# EAGLE design Sensor-amplification_V4 (EAGLE 6.6.0)
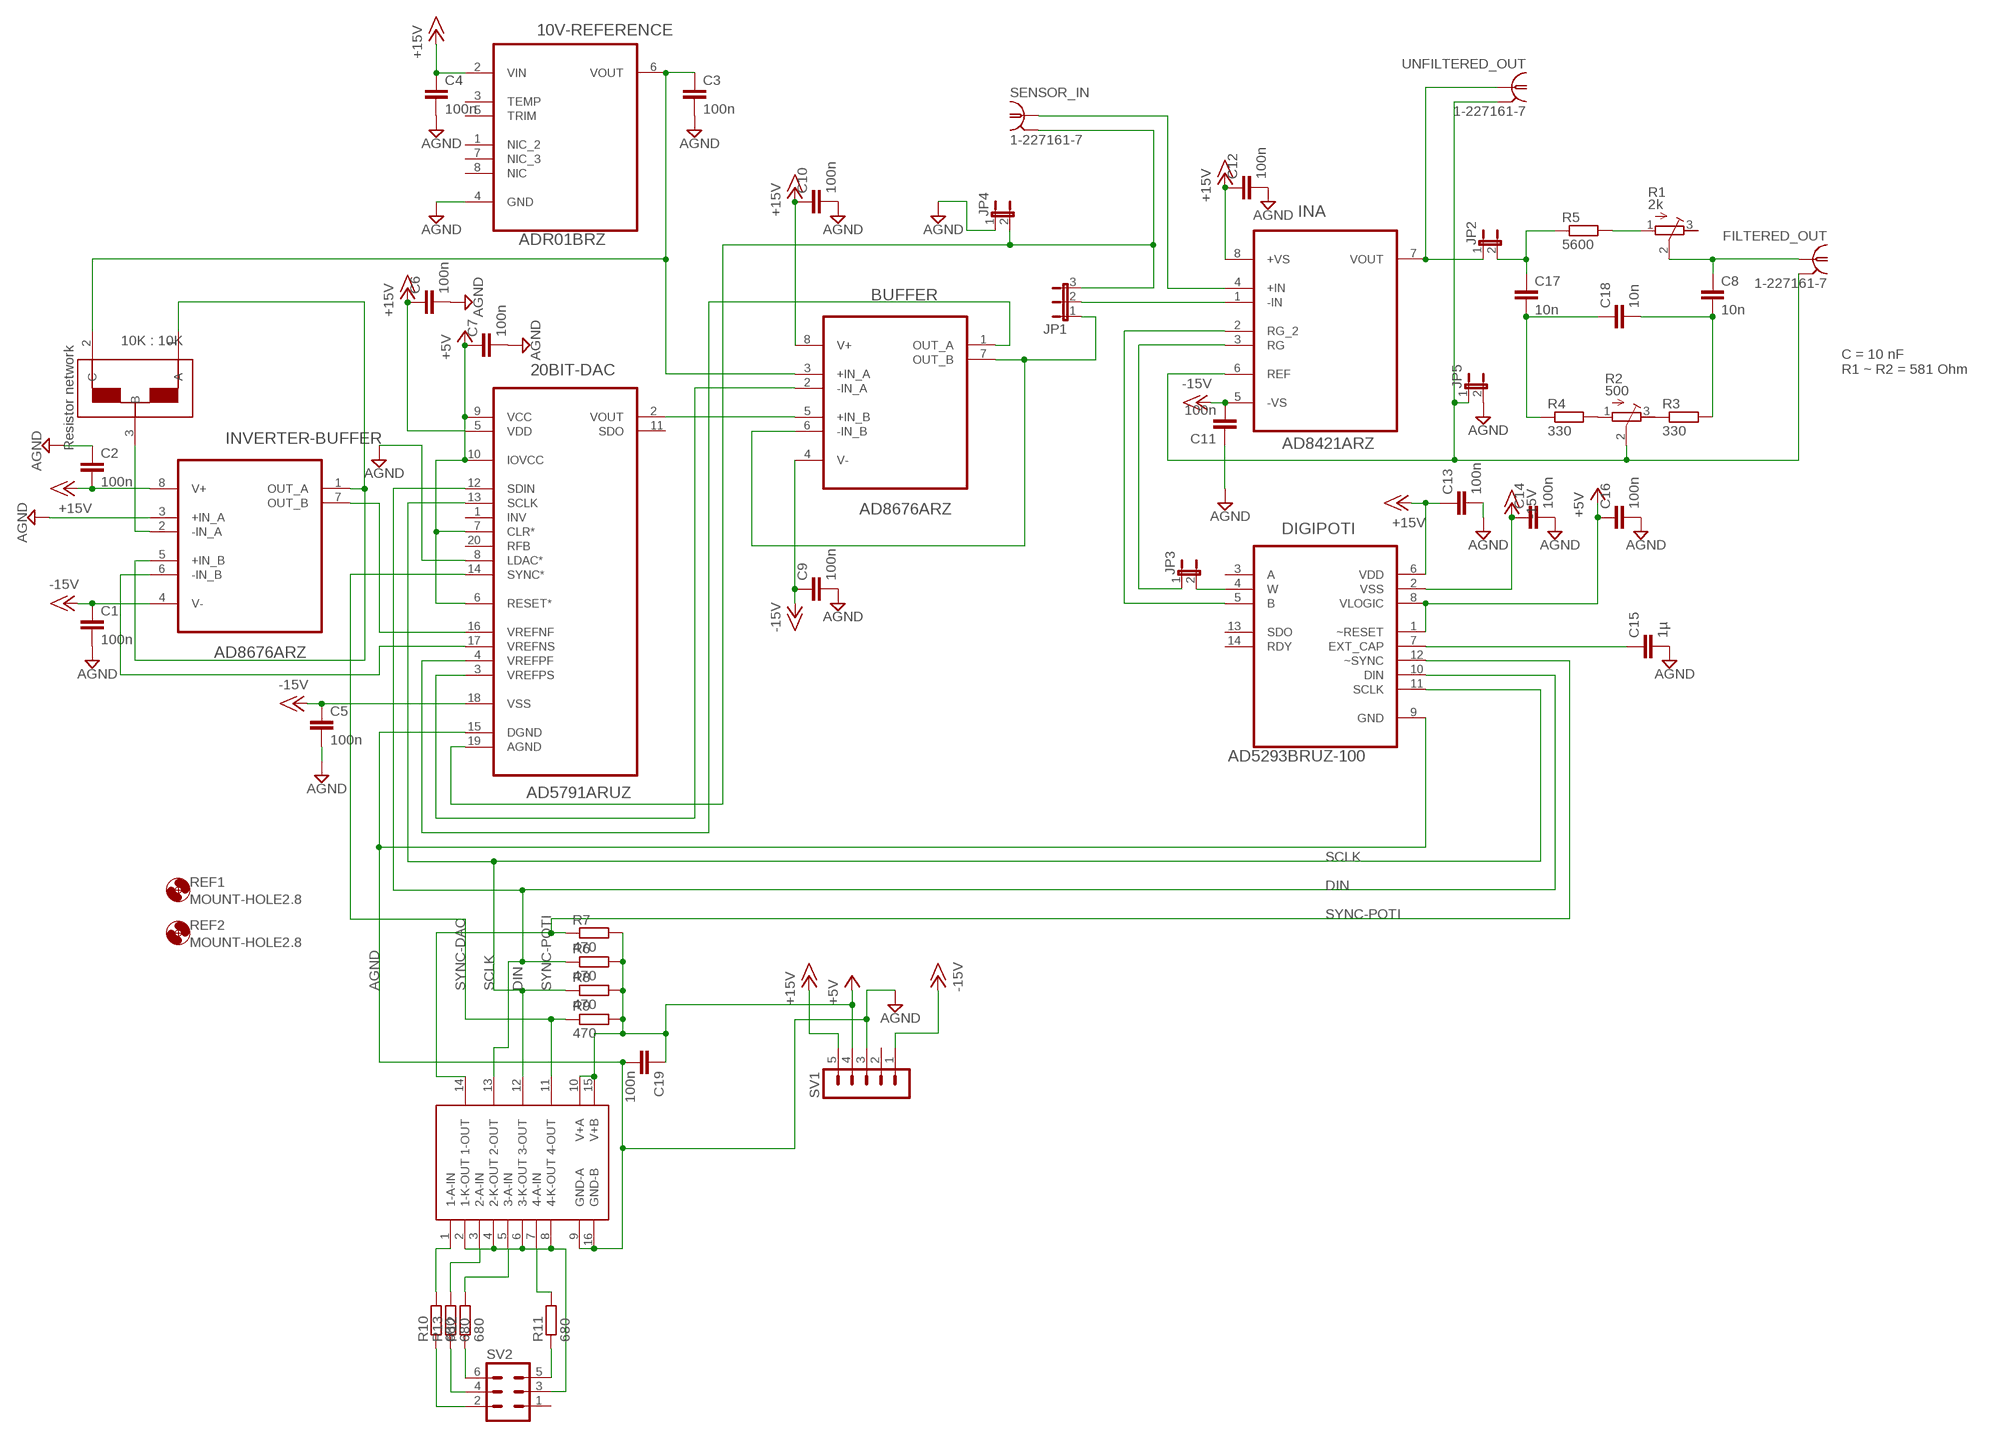
[diagram p0: schematic, sheet 1]

## Parts
10V-REFERENCE  ADR01BRZ  [SOIC127P600X175-8N]
20BIT-DAC  AD5791ARUZ  [SOP65P640X120-20N]
BUFFER  AD8676ARZ  [SOIC127P600X175-8N]
C1  100n  C-EUC0603  [C0603]
C2  100n  C-EUC0603  [C0603]
C3  100n  C-EUC0603  [C0603]
C4  100n  C-EUC0603  [C0603]
C5  100n  C-EUC0603  [C0603]
C6  100n  C-EUC0603  [C0603]
C7  100n  C-EUC0603  [C0603]
C8  10n  C-EUC0805  [C0805]
C9  100n  C-EUC0603  [C0603]
C10  100n  C-EUC0603  [C0603]
C11  100n  C-EUC0603  [C0603]
C12  100n  C-EUC0603  [C0603]
C13  100n  C-EUC0603  [C0603]
C14  100n  C-EUC0603  [C0603]
C15  1µ  C-EUC0603  [C0603]
C16  100n  C-EUC0603  [C0603]
C17  10n  C-EUC0805  [C0805]
C18  10n  C-EUC0805  [C0805]
C19  100n  C-EUC0603  [C0603]
DIGIPOTI  AD5293BRUZ-100  [SOP65P640X120-14N]
FILTERED_OUT  1-227161-7  [AMP_227161]
INA  AD8421ARZ  [SOIC127P600X175-8N]
INVERTER-BUFFER  AD8676ARZ  [SOIC127P600X175-8N]
JP1  JP2E  [JP2]
JP2  JP1E  [JP1]
JP3  JP1E  [JP1]
JP4  JP1E  [JP1]
JP5  JP1E  [JP1]
OPTOCOUPLER  ACSL-6400  [SO16]
R1  2k  R-TRIMM64W  [RTRIM64W]
R2  500  R-TRIMM64W  [RTRIM64W]
R3  330  R-EU_M1206  [M1206]
R4  330  R-EU_M1206  [M1206]
R5  5600  R-EU_M1206  [M1206]
R6  470  R-EU_M1206  [M1206]
R7  470  R-EU_M1206  [M1206]
R8  470  R-EU_M1206  [M1206]
R9  470  R-EU_M1206  [M1206]
R10  680  R-EU_M1206  [M1206]
R11  680  R-EU_M1206  [M1206]
R12  680  R-EU_M1206  [M1206]
R13  680  R-EU_M1206  [M1206]
R20  MPMT2001AT5  [SOT23]
REF1  MOUNT-HOLE2.8  [2,8]
REF2  MOUNT-HOLE2.8  [2,8]
SENSOR_IN  1-227161-7  [AMP_227161]
SV1  MA05-1  [MA05-1]
SV2  MA03-2  [MA03-2]
UNFILTERED_OUT  1-227161-7  [AMP_227161]

## Nets
+5V: 20BIT-DAC.6(RESET*) 20BIT-DAC.7(CLR*) 20BIT-DAC.9(VCC) 20BIT-DAC.10(IOVCC) C7.1 C16.1 C19.1 DIGIPOTI.1(~RESET) DIGIPOTI.8(VLOGIC) OPTOCOUPLER.10(V+A) OPTOCOUPLER.15(V+B) R6.2 R7.2 R8.2 R9.2 SV1.4
+15V: 10V-REFERENCE.2(VIN) 20BIT-DAC.5(VDD) BUFFER.8(V+) C2.2 C4.1 C6.1 C10.1 C12.1 C13.1 DIGIPOTI.6(VDD) INA.8(+VS) INVERTER-BUFFER.8(V+) SV1.5
-15V: 20BIT-DAC.18(VSS) BUFFER.4(V-) C1.1 C5.1 C9.1 C11.2 C14.1 DIGIPOTI.2(VSS) INA.5(-VS) INVERTER-BUFFER.4(V-) SV1.1
AGND: 10V-REFERENCE.4(GND) 20BIT-DAC.8(LDAC*) 20BIT-DAC.15(DGND) C1.2 C2.1 C3.2 C4.2 C5.2 C6.2 C7.2 C9.2 C10.2 C11.1 C12.2 C13.2 C14.2 C15.2 C16.2 C19.2 DIGIPOTI.9(GND) INVERTER-BUFFER.3(+IN_A) JP4.1 JP5.2 OPTOCOUPLER.9(GND-A) OPTOCOUPLER.16(GND-B) SV1.3
DIN: 20BIT-DAC.12(SDIN) DIGIPOTI.10(DIN) OPTOCOUPLER.13(2-OUT) R6.1
N$1: INA.7(VOUT) JP2.1 UNFILTERED_OUT.1
N$2: FILTERED_OUT.2 INA.6(REF) JP5.1 R2.2(S) UNFILTERED_OUT.2
N$3: INA.3(RG) JP3.1
N$4: DIGIPOTI.5(B) INA.2(RG_2)
N$5: INA.4(+IN) SENSOR_IN.1
N$6: 20BIT-DAC.19(AGND) JP1.3 JP4.2 SENSOR_IN.2
N$7: INA.1(-IN) JP1.2
N$8: DIGIPOTI.4(W) JP3.2
N$9: 10V-REFERENCE.6(VOUT) BUFFER.3(+IN_A) C3.1 R20.2(C)
N$10: 20BIT-DAC.2(VOUT) BUFFER.5(+IN_B)
N$11: 20BIT-DAC.4(VREFPF) BUFFER.1(OUT_A)
N$12: 20BIT-DAC.3(VREFPS) BUFFER.2(-IN_A)
N$13: INVERTER-BUFFER.2(-IN_A) R20.3(B)
N$14: 20BIT-DAC.16(VREFNF) INVERTER-BUFFER.7(OUT_B)
N$15: 20BIT-DAC.17(VREFNS) INVERTER-BUFFER.6(-IN_B)
N$16: INVERTER-BUFFER.1(OUT_A) INVERTER-BUFFER.5(+IN_B) R20.1(A)
N$17: C15.1 DIGIPOTI.7(EXT_CAP)
N$18: C17.2 C18.1 R4.1
N$19: C8.2 C18.2 R3.2
N$20: C8.1 FILTERED_OUT.1 R1.2(S)
N$21: C17.1 JP2.2 R5.1
N$22: R2.3(E) R3.1
N$23: R2.1(A) R4.2
N$24: R1.1(A) R5.2
N$25: OPTOCOUPLER.2(1-K-OUT) OPTOCOUPLER.4(2-K-OUT) OPTOCOUPLER.6(3-K-OUT) OPTOCOUPLER.8(4-K-OUT) SV2.3
N$26: OPTOCOUPLER.7(4-A-IN) R11.2
N$27: OPTOCOUPLER.5(3-A-IN) R12.2
N$28: OPTOCOUPLER.3(2-A-IN) R13.2
N$29: R10.1 SV2.2
N$30: OPTOCOUPLER.1(1-A-IN) R10.2
N$31: R13.1 SV2.4
N$32: R12.1 SV2.6
N$33: R11.1 SV2.5
SCLK: 20BIT-DAC.13(SCLK) DIGIPOTI.11(SCLK) OPTOCOUPLER.12(3-OUT) R8.1
SUBSTRACT_SELECT: BUFFER.6(-IN_B) BUFFER.7(OUT_B) JP1.1
SYNC-DAC: 20BIT-DAC.14(SYNC*) OPTOCOUPLER.11(4-OUT) R9.1
SYNC-POTI: DIGIPOTI.12(~SYNC) OPTOCOUPLER.14(1-OUT) R7.1
Unconnected: 10V-REFERENCE.1(NIC_2) 10V-REFERENCE.3(TEMP) 10V-REFERENCE.5(TRIM) 10V-REFERENCE.7(NIC_3) 10V-REFERENCE.8(NIC) 20BIT-DAC.1(INV) 20BIT-DAC.11(SDO) 20BIT-DAC.20(RFB) DIGIPOTI.3(A) DIGIPOTI.13(SDO) DIGIPOTI.14(RDY) R1.3(E) SV1.2 SV2.1

## Notes on the sheet
- 10K : 10K
- C = 10 nF
  R1 ~ R2 = 581 Ohm

## Library data of the parts
10V-REFERENCE = NaLi-specific:ADR01BRZ: Ultracompact, Precision 10.0 V/5.0 V/2.5 V/3.0 V Voltage References; MPN: ADR01BRZ; OC_FARNELL: 2305769; OC_NEWARK: 59K2657; PACKAGE: SOIC-8; SUPPLIER: Analog Devices
20BIT-DAC = NaLi-specific:AD5791ARUZ: Digital-to-Analog Converters; MPN: AD5791ARUZ; OC_FARNELL: 2074863; OC_NEWARK: 18T2142; PACKAGE: TSSOP-20; SUPPLIER: Analog Devices
BUFFER INVERTER-BUFFER = Analog Devices_By_element14_Batch_1:AD8676ARZ: Ultraprecision, 36 V, 2.8 nV/ãHz Dual Rail-to-Rail Output Op Amp; MPN: AD8676ARZ; OC_FARNELL: 1316453; OC_NEWARK: 28M4146; PACKAGE: SOIC-8; SUPPLIER: Analog Devices
C1-C19 = resistor:C-EU: CAPACITOR, European symbol
DIGIPOTI = NaLi-specific:AD5293BRUZ-100: Digital Potentiometers; MPN: AD5293BRUZ-100; OC_FARNELL: -; OC_NEWARK: 52R8122; PACKAGE: TSSOP-14; SUPPLIER: Analog Devices
FILTERED_OUT SENSOR_IN UNFILTERED_OUT = con-coax:?227161*: JACK, RIGHT ANGLE, 50 OHM, PCB, BNC Source: amp_227161.pdf; MF: TYCO ELECTRONICS; MPN: 1-227161-7; OC_FARNELL: unknown; OC_NEWARK: 09H7855
INA = ADI-Phase-2:AD8421ARZ: Instrumentation Amplifier; MPN: AD8421ARZ; OC_FARNELL: 2126090; OC_NEWARK: 94T9482; PACKAGE: SOIC-8; SUPPLIER: Analog Devices
JP1 = jumper:JP2E: JUMPER
JP2-JP5 = jumper:JP1E: JUMPER
OPTOCOUPLER = NaLi-specific:ACSL-6400
R1 R2 = resistor:R-TRIMM: Trimm resistor
R3-R13 = resistor:R-EU_: RESISTOR, European symbol
R20 = NaLi-specific:MPMT2001AT5
REF1 REF2 = holes:MOUNT-HOLE: MOUNTING HOLE with drill center marker
SV1 = con-lstb:MA05-1: PIN HEADER; OC_FARNELL: unknown; OC_NEWARK: unknown
SV2 = con-lstb:MA03-2: PIN HEADER; OC_FARNELL: unknown; OC_NEWARK: unknown

## Board
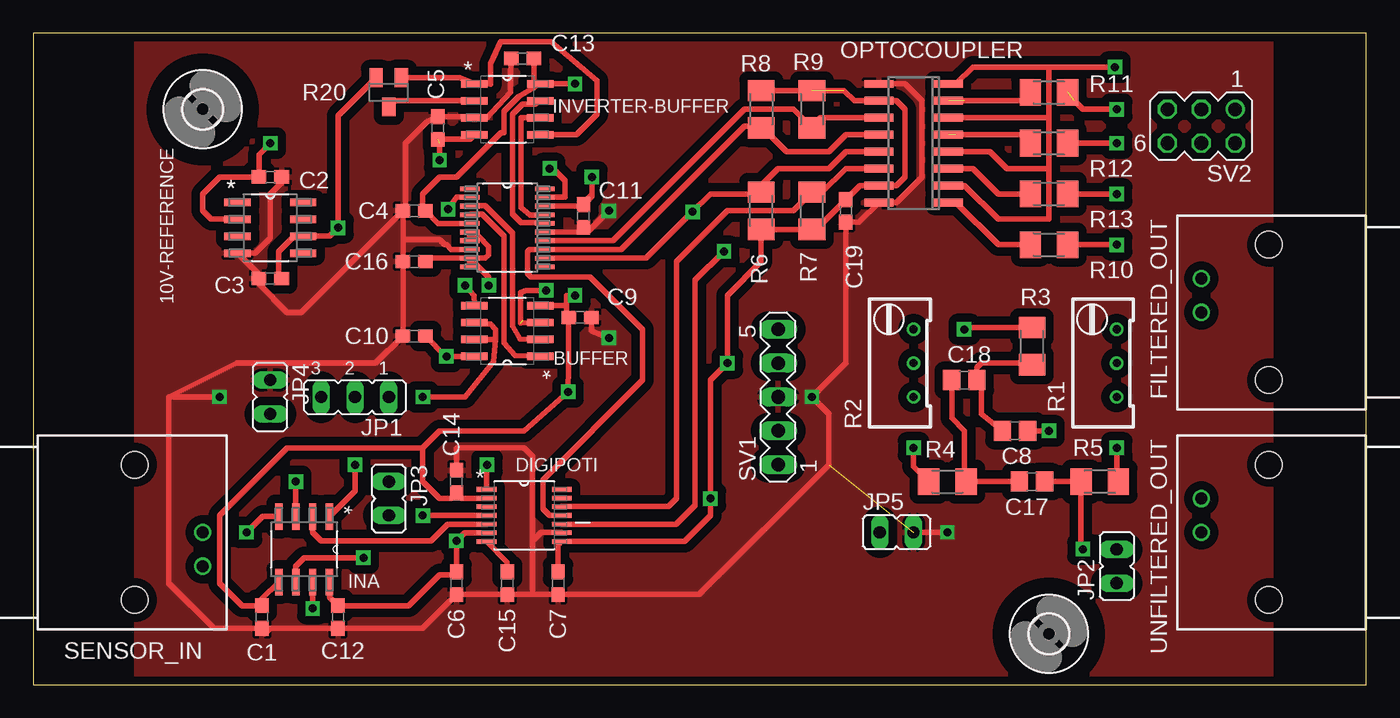
[diagram p1: board, top side]
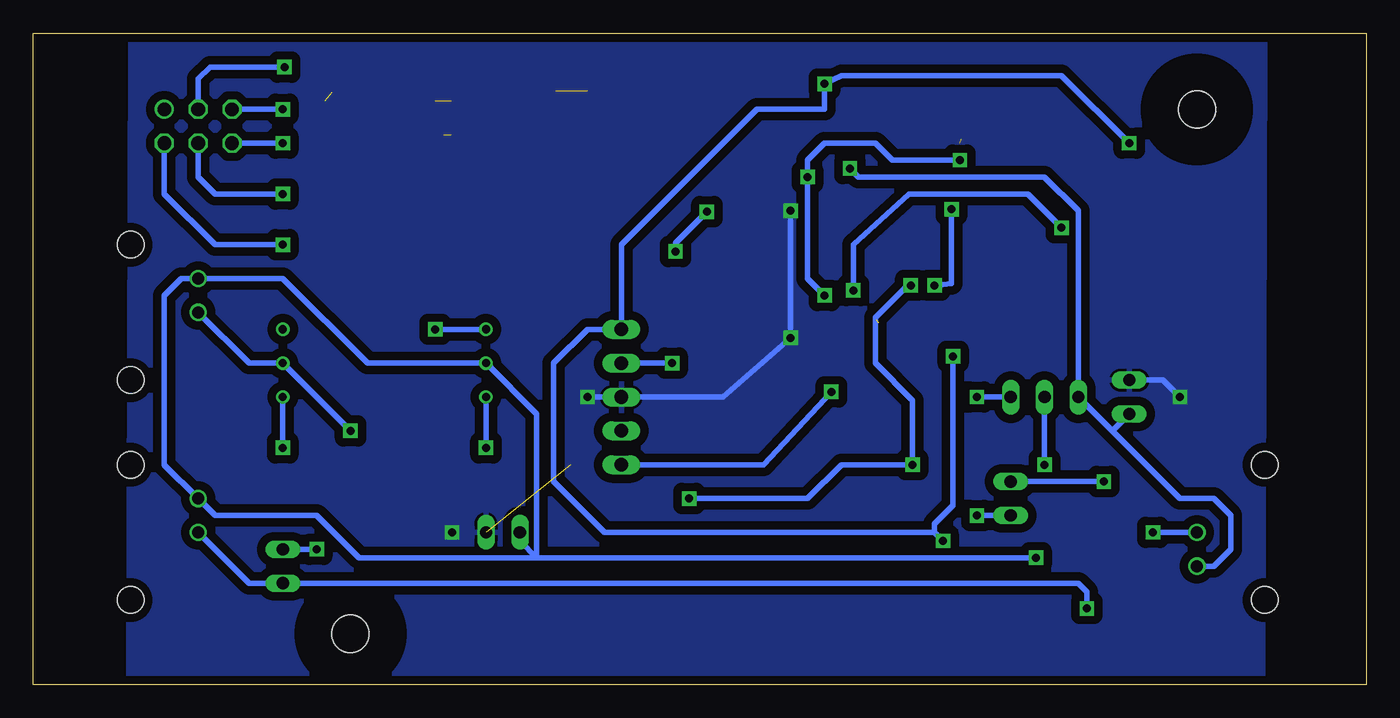
[diagram p2: board, bottom side, seen from below]

Size 100 x 48.88 mm. Coordinates in mm from the lower left corner, seen from the top.
Outline: 0,0 100,0 100,48.88 0,48.88 0,0
Copper layers (1*16): Top 0.035mm / dielectric 1.5mm / Bottom 0.035mm
Design rules "PCB-POOL Standard": minimum track width 0.15mm, minimum drill 0.3mm, track to track 0.15mm, track to pad 0.15mm, pad to pad 0.15mm, via to via 0.15mm, smd to smd 0.15mm, copper to edge 0.3mm, drill to drill 0.2mm, minimum pad ring 0.2mm, minimum via ring 0.15mm, stop-mask expansion 0.075mm, vias tented up to drill 0mil, thermal gap 0.2mm

### Footprints (pad centres in the part's own frame; a part is rotated, then mirrored left to right if it is on the bottom)
SOIC127P600X175-8N = smd 1.981 x 0.559: 1 -2.464,1.905; 2 -2.464,0.635; 3 -2.464,-0.635; 4 -2.464,-1.905; 5 2.464,-1.905; 6 2.464,-0.635; 7 2.464,0.635; 8 2.464,1.905
SOP65P640X120-20N = smd 1.473 x 0.356: 1 -2.819,2.921; 2 -2.819,2.286; 3 -2.819,1.626; 4 -2.819,0.965; 5 -2.819,0.33; 6 -2.819,-0.33; 7 -2.819,-0.965; 8 -2.819,-1.626; 9 -2.819,-2.286; 10 -2.819,-2.921; 11 2.819,-2.921; 12 2.819,-2.286; 13 2.819,-1.626; 14 2.819,-0.965; 15 2.819,-0.33; 16 2.819,0.33; 17 2.819,0.965; 18 2.819,1.626; 19 2.819,2.286; 20 2.819,2.921
C0603 = smd 1.1 x 1: 1 -0.85,0; 2 0.85,0
C0805 = smd 1.3 x 1.5: 1 -0.95,0; 2 0.95,0
SOP65P640X120-14N = smd 1.473 x 0.356: 1 -2.819,1.956; 2 -2.819,1.295; 3 -2.819,0.66; 4 -2.819,0; 5 -2.819,-0.66; 6 -2.819,-1.295; 7 -2.819,-1.956; 8 2.819,-1.956; 9 2.819,-1.295; 10 2.819,-0.66; 11 2.819,0; 12 2.819,0.66; 13 2.819,1.295; 14 2.819,1.956
AMP_227161 = drill 0.9 pad 1.27: 1 0,-5.08; 2 -2.54,-5.08 | hole 2: -5.08,0; 5.08,0
JP2 = drill 0.914 long: 1 -2.54,0; 2 0,0; 3 2.54,0
JP1 = drill 0.914 long: 1 0,-1.27; 2 0,1.27
SO16 = smd 0.6 x 2.2: 1 -4.445,-2.6; 2 -3.175,-2.6; 3 -1.905,-2.6; 4 -0.635,-2.6; 5 0.635,-2.6; 6 1.905,-2.6; 7 3.175,-2.6; 8 4.445,-2.6; 9 4.445,2.6; 10 3.175,2.6; 11 1.905,2.6; 12 0.635,2.6; 13 -0.635,2.6; 14 -1.905,2.6; 15 -3.175,2.6; 16 -4.445,2.6
RTRIM64W = drill 0.61: 1 1.27,-2.54; 2 1.27,0; 3 1.27,2.54
M1206 = smd 1.6 x 2: 1 -1.4,0; 2 1.4,0
SOT23 = smd 1 x 1.4: 1 -0.95,-1.1; 2 0.95,-1.1; 3 0,1.1
2,8 = hole 2.8: 0,0
MA05-1 = drill 1.016 long: 1 -5.08,0; 2 -2.54,0; 3 0,0; 4 2.54,0; 5 5.08,0
MA03-2 = drill 1.016: 1 -2.54,-1.27 | drill 1.016 octagon: 2 -2.54,1.27; 3 0,-1.27; 4 0,1.27; 5 2.54,-1.27; 6 2.54,1.27

### Placement (x,y rotation side)
10V-REFERENCE  17.78,34.29 0 top
20BIT-DAC  35.56,34.29 0 top
BUFFER  35.56,26.54 180 top
C1  17.14,5.08 270 top
C2  17.78,38.1 180 top
C3  17.78,30.48 180 top
C4  28.57,35.56 180 top
C5  30.35,41.78 90 top
C6  31.75,7.62 270 top
C7  39.37,7.62 270 top
C8  73.66,19.05 180 top
C9  41.02,27.56 0 top
C10  28.57,26.16 180 top
C11  41.27,35.18 90 top
C12  22.86,5.08 270 top
C13  36.7,46.99 180 top
C14  31.75,15.24 90 top
C15  35.56,7.62 270 top
C16  28.57,31.75 180 top
C17  74.93,15.24 180 top
C18  69.85,22.86 0 top
C19  60.96,35.56 270 top
DIGIPOTI  36.83,12.7 0 top
FILTERED_OUT  92.71,27.94 270 top
INA  20.32,10.16 270 top
INVERTER-BUFFER  35.56,43.18 0 top
JP1  24.13,21.59 180 top
JP2  81.28,8.89 0 top
JP3  26.67,13.97 180 top
JP4  17.78,21.59 180 top
JP5  64.77,11.43 270 top
OPTOCOUPLER  66.04,40.64 90 top
R1  80.01,24.13 0 top
R2  64.77,24.13 0 top
R3  74.93,25.4 270 top
R4  68.58,15.24 180 top
R5  80.01,15.24 0 top
R6  54.61,35.56 270 top
R7  58.42,35.56 270 top
R8  54.61,43.18 90 top
R9  58.42,43.18 90 top
R10  76.2,33.02 180 top
R11  76.2,44.45 180 top
R12  76.2,40.64 180 top
R13  76.2,36.83 180 top
R20  26.67,44.45 180 top
REF1  12.7,43.18 0 top
REF2  76.2,3.81 0 top
SENSOR_IN  7.62,11.43 90 top
SV1  55.88,21.59 90 top
SV2  87.63,41.91 180 top
UNFILTERED_OUT  92.71,11.43 270 top

### Tracks (layer width: path | path; a pad name or v marks a point on that pad's centre or on a via)
+5V  (via drill 0.6)  (1 unrouted)
  Top 0.406: C7.1 39.37,10.46 DIGIPOTI.8 48.84,10.74 50.8,12.7 v50.8,13.97 50.8,22.86 v52.07,24.13 52.07,29.21 54.61,31.75 R6.2 R7.2 58.71,34.16 C19.1 62.02,37.46 OPTOCOUPLER.15 64.77,37.46 65.41,38.1 65.41,43.18 64.77,43.81 OPTOCOUPLER.10 61.59,43.81 60.83,44.58 R8.2 | C16.1 29.68,32 20BIT-DAC.9 | 20BIT-DAC.10 20BIT-DAC.9 | DIGIPOTI.1 34.01,16.48 v34.04,16.51 | v34.16,29.97 34.16,30.58 20BIT-DAC.9 | 20BIT-DAC.9 33.91,32 34.16,32.26 34.16,32.89 33.4,33.66 33.07,33.66 20BIT-DAC.7 20BIT-DAC.6
  Bottom 0.406: v50.8,13.97 41.91,13.97 39.37,16.51 v34.04,16.51 34.04,21.34 36.83,24.13 36.83,27.56 34.42,29.97 v34.16,29.97 | SV1.4 v52.07,24.13
+15V  (via drill 0.6)
  Top 0.406: INA.8 22.23,6.57 C12.1 28.16,5.93 30.48,8.25 31.54,8.25 C6.1 v31.75,10.8 32.36,11.41 DIGIPOTI.6 | 10V-REFERENCE.2 13.34,34.92 12.7,35.56 12.7,36.83 13.97,38.1 C2.2 16.93,39.79 v17.78,40.64 | 20BIT-DAC.5 30.36,34.62 C4.1 29.21,35.77 29.21,36.83 30.48,38.1 31.75,38.1 35.09,41.44 35.31,41.44 35.31,43.05 36.4,44.14 37.55,44.81 | 37.55,44.81 INVERTER-BUFFER.8 v40.64,45.09 | C13.1 37.55,44.81 | BUFFER.8 v30.99,24.64 30.95,24.64 C10.1
  Bottom 0.406: 32.38,11.43 57.15,11.43 60.96,15.24 60.96,24.13 58.42,26.67 SV1.5 55.88,33.02 45.72,43.18 40.64,43.18 v40.64,45.09 39.37,45.72 22.86,45.72 v17.78,40.64 | 32.38,11.43 v31.75,10.8 | 32.38,11.43 32.38,12.07 30.99,13.46 v30.99,24.64
-15V  (via drill 0.6)  (1 unrouted)
  Top 0.406: INA.5 17.14,6.43 C1.1 15.66,5.93 13.97,7.62 13.97,12.7 19.05,17.78 29.21,17.78 | DIGIPOTI.2 32.15,14 C14.1 31.33,13.97 30.48,13.97 29.21,15.24 29.21,17.78 | 30.48,40.64 v30.48,39.37 | 41.91,36.83 41.91,36.66 C11.2 41.16,35.92 20BIT-DAC.18 41,35.92 41.91,36.83 | 41.91,36.83 v41.91,38.1 | v40.64,29.21 40.01,29.21 40.01,28.45 | 29.21,17.78 30.48,19.05 36.83,19.05 v40.13,21.97 40.17,23.91 C9.1 40.01,27.72 40.01,28.45 | BUFFER.4 40.01,28.45 | INVERTER-BUFFER.4 32.75,40.93 C5.1
  Bottom 0.406: SV1.1 45.21,16.51 v40.13,21.97 | v30.48,39.37 35.56,39.37 36.83,40.64 40.64,40.64 41.91,39.37 v41.91,38.1 41.91,30.48 v40.64,29.21
AGND  (via drill 0.6)  (1 unrouted)
  Top 0.406: OPTOCOUPLER.9 65.41,45.09 66.67,43.81 66.67,38.1 64.77,36.2 OPTOCOUPLER.16 61.95,34.71 C19.2 60.96,24.13 v58.42,21.59 59.69,20.32 59.69,16.51 49.95,6.77 C7.2 37.47,6.77 | 37.47,6.77 C15.2 C6.2 29.21,4.23 C12.2 17.78,4.23 | 17.78,4.23 C1.2 13.55,4.23 10.16,7.62 10.16,21.59 | DIGIPOTI.9 39.62,11.43 38.1,11.43 37.47,10.8 | 37.47,10.8 37.47,6.77 | C2.1 18.63,37.68 17.78,36.83 17.78,33.53 16.64,32.38 10V-REFERENCE.4 16.93,30.77 C3.2 16.93,30.06 19.05,27.94 20.11,27.94 C4.2 | C16.2 27.94,31.54 | C16.2 27.73,33.27 | 27.73,33.27 C4.2 | C4.2 27.94,35.77 27.94,40.64 29.55,42.25 C5.2 33.01,42.63 INVERTER-BUFFER.3 33.96,42.47 35.81,44.45 35.81,45.55 C13.2 | 17.36,3.81 17.78,4.23 | 20BIT-DAC.15 40.91,33.96 | 40.91,33.96 C11.1 | 40.91,33.96 41.58,33.96 v43.18,35.56 | v43.18,26.04 41.87,26.54 C9.2 | 37.47,10.8 37.47,17.14 36.83,17.78 31.75,17.78 C14.2 | 20BIT-DAC.8 31.34,32.66 30.99,33.02 30.86,33.02 30.48,33.4 27.85,33.4 27.73,33.27 | 10.16,21.59 15.24,24.13 25.69,24.13 C10.2 C16.2 | v13.97,21.59 10.16,21.59 | JP5.2 v68.58,11.43
  Bottom 0.406: v43.18,35.56 v43.18,26.04 48.26,21.59 SV1.3 v58.42,21.59 | JP4.1 15.24,22.86 v13.97,21.59
  pour Top (isolate 0.635): 7.75,49.53 7.75,-0.76 92.84,-0.76 92.84,49.53
  pour Bottom (isolate 0.635): 7.62,48.26 7.75,0.64 92.84,0.64 92.71,48.26
DIN  (via drill 0.6)
  Top 0.406: OPTOCOUPLER.13 60.96,40.01 59.69,38.73 55.88,38.73 54.61,37.46 R6.1 54.48,36.83 50.8,36.83 v49.47,35.5 45.97,32 20BIT-DAC.12 | DIGIPOTI.10 48.23,12.04 49.66,13.46 49.66,30.35 v51.82,32.51
  Bottom 0.406: v51.82,32.51 51.82,33.15 v49.47,35.5
N$1  (via drill 0.6)
  Top 0.406: INA.7 v20.95,5.71
  Bottom 0.406: UNFILTERED_OUT.1 83.82,7.62 JP2.1 21.59,7.62 20.95,6.99 v20.95,5.71
N$2  (via drill 0.6)
  Top 0.406: INA.6 19.68,8.89 20.32,9.53 v24.77,9.53
  Bottom 0.406: 62.23,9.53 75.56,9.53 78.74,12.7 86.36,12.7 UNFILTERED_OUT.2 90.17,16.51 90.17,29.21 88.9,30.48 FILTERED_OUT.2 81.28,30.48 74.93,24.13 R2.2 62.23,20.32 62.23,9.53 | 62.23,9.53 v24.77,9.53 | 62.23,9.53 63.5,10.8 JP5.1
N$3  (via drill 0.6)
  Top 0.406: v19.68,15.24 INA.3
  Bottom 0.406: JP3.1 v19.68,15.24
N$4
  Top 0.406: INA.2 20.95,11.43 21.59,10.8 29.84,10.8 31.09,12.04 DIGIPOTI.5
N$5  (via drill 0.6)
  Top 0.406: v16,11.43 17.2,12.62 INA.4
  Bottom 0.406: SENSOR_IN.1 v16,11.43
N$6  (via drill 0.6)
  Top 0.406: 20BIT-DAC.19 39.88,36.58 39.88,37.85 38.99,38.73 v38.73,38.73
  Bottom 0.406: SENSOR_IN.2 11.43,8.89 10.16,10.16 10.16,12.7 11.43,13.97 13.97,13.97 19.05,19.05 | 19.05,19.05 JP1.3 21.59,35.56 24.13,38.1 38.1,38.1 v38.73,38.73 | JP4.2 19.05,19.05
N$7  (via drill 0.6)
  Top 0.406: INA.1 24.13,14.53 v24.13,16.51
  Bottom 0.406: v24.13,16.51 JP1.2
N$8  (via drill 0.6)
  Top 0.406: v29.21,12.7 DIGIPOTI.4
  Bottom 0.406: JP3.2 v29.21,12.7
N$9  (via drill 0.6)  (1 unrouted)
  Top 0.406: C3.1 18.41,30.7 18.41,32.51 19.56,33.66 10V-REFERENCE.6 22.23,33.66 v22.86,34.29 22.86,42.69 R20.2 | BUFFER.3 36.54,27.12 36.54,29.43 36.96,29.59 v38.48,29.59
  Bottom 0.406: v38.48,29.59 38.48,33.02 34.29,36.83 25.4,36.83 v22.86,34.29
N$10  (via drill 0.6)
  Top 0.406: 20BIT-DAC.2 31.75,36.58 v31.11,35.69 | v32.38,29.97 33.07,29.21 BUFFER.5
  Bottom 0.406: v31.11,35.69 31.11,30.1 v32.38,29.97
N$11
  Top 0.406: BUFFER.1 36.14,24.69 35.31,25.65 35.31,33.66 33.66,35.31 32.79,35.31 20BIT-DAC.4
N$12
  Top 0.406: BUFFER.2 36.52,25.96 35.94,26.92 35.94,33.91 33.91,35.94 32.77,35.94 20BIT-DAC.3
N$13
  Top 0.406: 26.83,43.51 R20.3 27.14,43.81 INVERTER-BUFFER.2
N$14
  Top 0.406: 20BIT-DAC.16 38.33,34.67 36.58,34.67 35.94,35.31 35.94,42.8 36.7,43.56 37.69,43.56 INVERTER-BUFFER.7
N$15
  Top 0.406: 20BIT-DAC.17 37.26,35.26 36.58,35.81 36.58,42.55 INVERTER-BUFFER.6
N$16
  Top 0.406: R20.1 31.97,45.55 INVERTER-BUFFER.1 34.29,45.06 34.29,46.61 35.05,48.26 38.86,48.26 42.29,45.34 42.29,42.8 40.77,41.27 INVERTER-BUFFER.5
N$17
  Top 0.406: DIGIPOTI.7 35.56,9.2 C15.1
N$18
  Top 0.406: C17.2 R4.1 69.85,15.37 69.85,19.05 68.9,20 C18.1
N$19
  Top 0.406: R3.2 74.8,24.13 71.12,24.13 70.8,23.81 C18.2 71.12,22.54 71.12,20.32 C8.2
N$20  (via drill 0.6)
  Top 0.406: C8.1 v76.2,19.05
  Bottom 0.406: v76.2,19.05 R1.2 83.82,24.13 FILTERED_OUT.1
N$21  (via drill 0.6)
  Top 0.406: C17.1 R5.1 78.61,10.29 v78.74,10.16
  Bottom 0.406: JP2.2 v78.74,10.16
N$22  (via drill 0.6)
  Top 0.406: v69.85,26.67 69.98,26.8 R3.1
  Bottom 0.406: R2.3 v69.85,26.67
N$23  (via drill 0.6)
  Top 0.406: R4.2 66.04,16.38 v66.04,17.78
  Bottom 0.406: v66.04,17.78 R2.1
N$24  (via drill 0.6)
  Top 0.406: R5.2 81.28,15.37 v81.28,17.78
  Bottom 0.406: v81.28,17.78 R1.1
N$25  (via drill 0.6)
  Top 0.406: 76.2,46.35 70.48,46.35 69.22,45.09 OPTOCOUPLER.8 | OPTOCOUPLER.6 76.2,42.55 | 76.2,42.55 76.2,46.35 | OPTOCOUPLER.4 71.75,40.01 73.03,38.73 76.2,38.73 | 76.2,38.73 76.2,42.55 | OPTOCOUPLER.2 69.85,37.46 72.39,34.92 76.2,34.92 76.2,38.73 | 76.2,46.35 v81.15,46.35
  Bottom 0.406: v81.15,46.35 86.74,46.35 87.63,45.47 SV2.3
N$26  (1 unrouted)
  Top 0.406: R11.2 74.17,43.81 69.85,43.81
N$27  (1 unrouted)
  Top 0.406: R12.2 74.17,41.27 69.22,41.27
N$28
  Top 0.406: R13.2 72.39,36.83 70.48,38.73 OPTOCOUPLER.3
N$29  (via drill 0.6)
  Top 0.406: R10.1 v81.28,33.02
  Bottom 0.406: v81.28,33.02 86.36,33.02 90.17,36.83 SV2.2
N$30
  Top 0.406: R10.2 72.39,33.02 69.22,36.2 OPTOCOUPLER.1
N$31  (via drill 0.6)
  Top 0.406: R13.1 v81.28,36.83
  Bottom 0.406: v81.28,36.83 86.36,36.83 87.63,38.1 SV2.4
N$32  (via drill 0.6)
  Top 0.406: R12.1 v81.28,40.64
  Bottom 0.406: v81.28,40.64 SV2.6
N$33  (via drill 0.6)  (1 unrouted)
  Top 0.406: 78.11,43.81 78.74,43.18 v81.28,43.18
  Bottom 0.406: v81.28,43.18 SV2.5
SCLK
  Top 0.406: OPTOCOUPLER.12 60.96,41.27 59.69,40.01 56.52,40.01 54.74,41.78 R8.1 54.48,41.91 53.34,41.91 44.09,32.66 20BIT-DAC.13 37.24,32.66 37.08,32.51 37.08,30.86 37.34,30.61 41.78,30.61 45.72,26.67 45.72,22.86 38.23,15.37 38.23,13.21 38.73,12.7 DIGIPOTI.11
SUBSTRACT_SELECT  (via drill 0.6)
  Top 0.406: 34.67,25.91 34.54,24.26 32.38,21.59 v29.21,21.59 | 34.67,25.91 34.67,26.67 34.29,27.05 33.43,27.05 BUFFER.6 | BUFFER.7 34.67,25.91
  Bottom 0.406: JP1.1 v29.21,21.59
SYNC-DAC
  Top 0.406: OPTOCOUPLER.11 59.05,42.55 58.42,41.91 R9.1 57.02,43.18 53.34,43.18 43.48,33.33 20BIT-DAC.14
SYNC-POTI
  Top 0.406: OPTOCOUPLER.14 60.96,38.73 59.19,36.96 R7.1 57.02,35.56 52.07,35.56 48.26,31.75 48.26,13.97 47.65,13.36 DIGIPOTI.12

### Text on the board
tDocu: V 4 / F. Jendrzejewski 2016